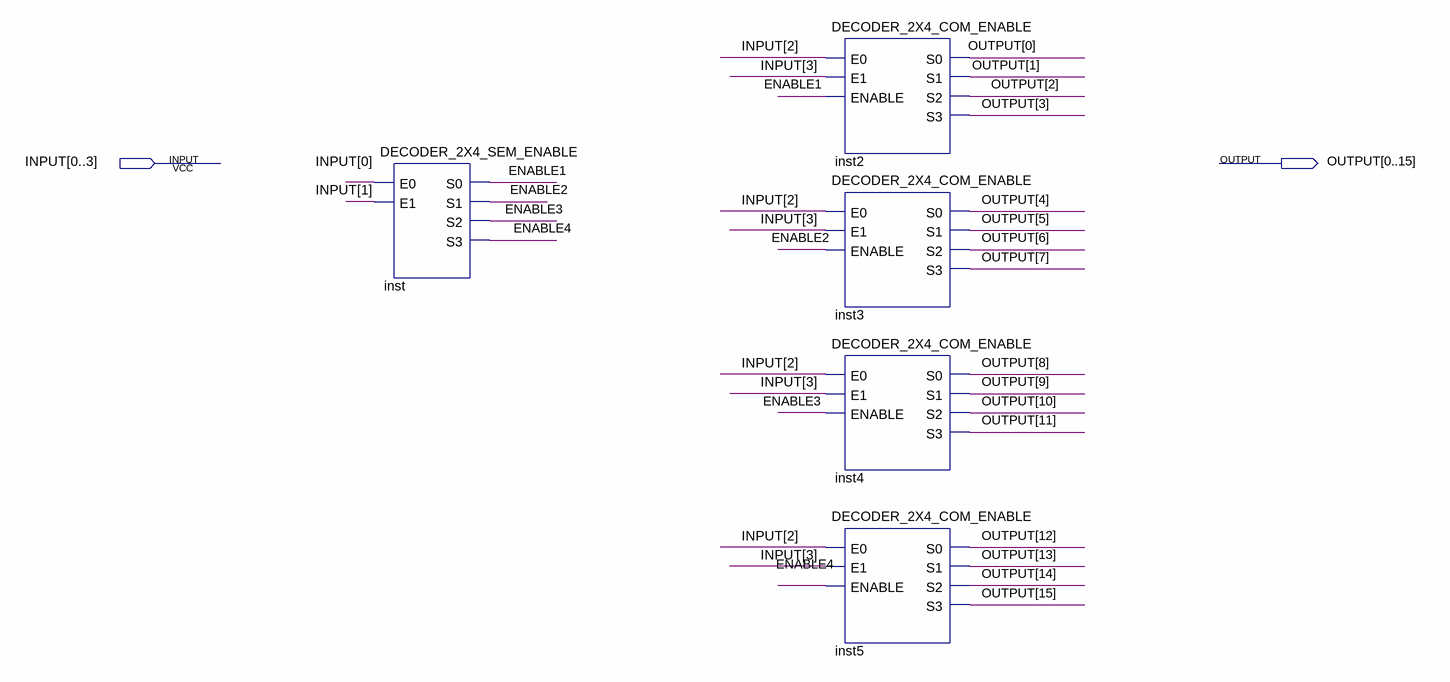
[diagram p0: schematic sheet]
// Quartus schematic DECODER_4X16.bdf as structural Verilog: 5 symbols, 2 pins
module DECODER_4X16 (
  input  [0:3] INPUT,
  output [0:15] OUTPUT
);

  wire ENABLE1, ENABLE2, ENABLE3, ENABLE4;

  DECODER_2X4_SEM_ENABLE inst (.E0(INPUT[0]), .E1(INPUT[1]), .S0(ENABLE1), .S1(ENABLE2), .S2(ENABLE3), .S3(ENABLE4));
  DECODER_2X4_COM_ENABLE inst2 (
    .E0(INPUT[2]), .E1(INPUT[3]), .ENABLE(ENABLE1), .S0(OUTPUT[0]), .S1(OUTPUT[1]), .S2(OUTPUT[2]),
    .S3(OUTPUT[3]));
  DECODER_2X4_COM_ENABLE inst3 (
    .E0(INPUT[2]), .E1(INPUT[3]), .ENABLE(ENABLE2), .S0(OUTPUT[4]), .S1(OUTPUT[5]), .S2(OUTPUT[6]),
    .S3(OUTPUT[7]));
  DECODER_2X4_COM_ENABLE inst4 (
    .E0(INPUT[2]), .E1(INPUT[3]), .ENABLE(ENABLE3), .S0(OUTPUT[8]), .S1(OUTPUT[9]), .S2(OUTPUT[10]),
    .S3(OUTPUT[11]));
  DECODER_2X4_COM_ENABLE inst5 (
    .E0(INPUT[2]), .E1(INPUT[3]), .ENABLE(ENABLE4), .S0(OUTPUT[12]), .S1(OUTPUT[13]), .S2(OUTPUT[14]),
    .S3(OUTPUT[15]));
endmodule
